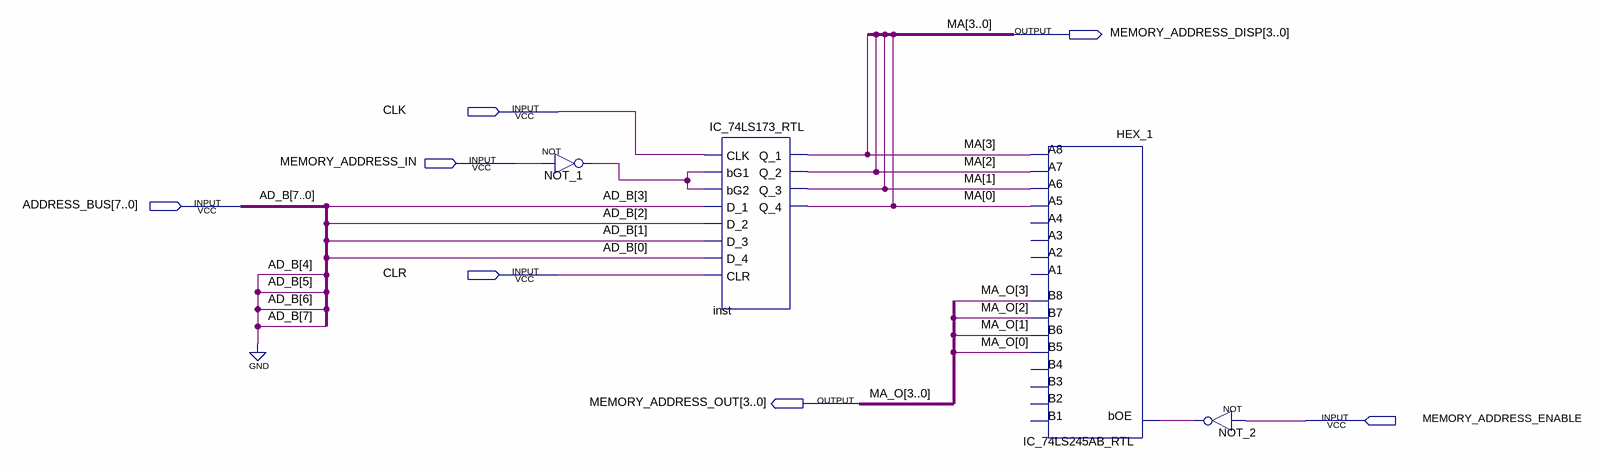
[diagram p0: schematic sheet]
// Quartus schematic Memory_Address_Register.bdf as structural Verilog: 4 symbols, 7 pins
module Memory_Address_Register (
  input  CLK,
  input  MEMORY_ADDRESS_IN,
  input  [7:0] ADDRESS_BUS,
  input  CLR,
  input  MEMORY_ADDRESS_ENABLE,
  output [3:0] MEMORY_ADDRESS_DISP,
  output [3:0] MEMORY_ADDRESS_OUT
);

  wire NOT_1_out, NOT_2_out;

  not NOT_1 (NOT_1_out, MEMORY_ADDRESS_IN);
  IC_74LS173_RTL inst (
    .CLK(CLK), .bG1(NOT_1_out), .bG2(NOT_1_out), .D_1(ADDRESS_BUS[3]), .D_2(ADDRESS_BUS[2]),
    .D_3(ADDRESS_BUS[1]), .D_4(ADDRESS_BUS[0]), .CLR(CLR), .Q_1(MEMORY_ADDRESS_DISP[3]),
    .Q_2(MEMORY_ADDRESS_DISP[2]), .Q_3(MEMORY_ADDRESS_DISP[1]), .Q_4(MEMORY_ADDRESS_DISP[0]));
  IC_74LS245AB_RTL HEX_1 (
    .bOE(NOT_2_out), .A5(MEMORY_ADDRESS_DISP[0]), .A6(MEMORY_ADDRESS_DISP[1]), .A7(MEMORY_ADDRESS_DISP[2]),
    .A8(MEMORY_ADDRESS_DISP[3]), .B5(MEMORY_ADDRESS_OUT[0]), .B6(MEMORY_ADDRESS_OUT[1]),
    .B7(MEMORY_ADDRESS_OUT[2]), .B8(MEMORY_ADDRESS_OUT[3]));  // open: A1, A2, A3, A4, B1, B2, B3, B4
  not NOT_2 (NOT_2_out, MEMORY_ADDRESS_ENABLE);

  assign ADDRESS_BUS[6:4] = {3{ADDRESS_BUS[7]}};
  // also tied to GND on the sheet: ADDRESS_BUS[7]

  // Other names for the same wires on the sheet: AD_B[7:0] = {{4{ADDRESS_BUS[7]}}, ADDRESS_BUS[3:0]};
  //   MA[3:0] = MEMORY_ADDRESS_DISP; MA_O[3:0] = MEMORY_ADDRESS_OUT
endmodule
